# Altium schematic sheet RS485_ISO.SchDoc
size 420 x 297 mm; Organization: Altium Limited; Address1: L3, 12a Rodborough Rd; Address2: Frenchs Forest; Address3: NSW; Address4: Australia 2086
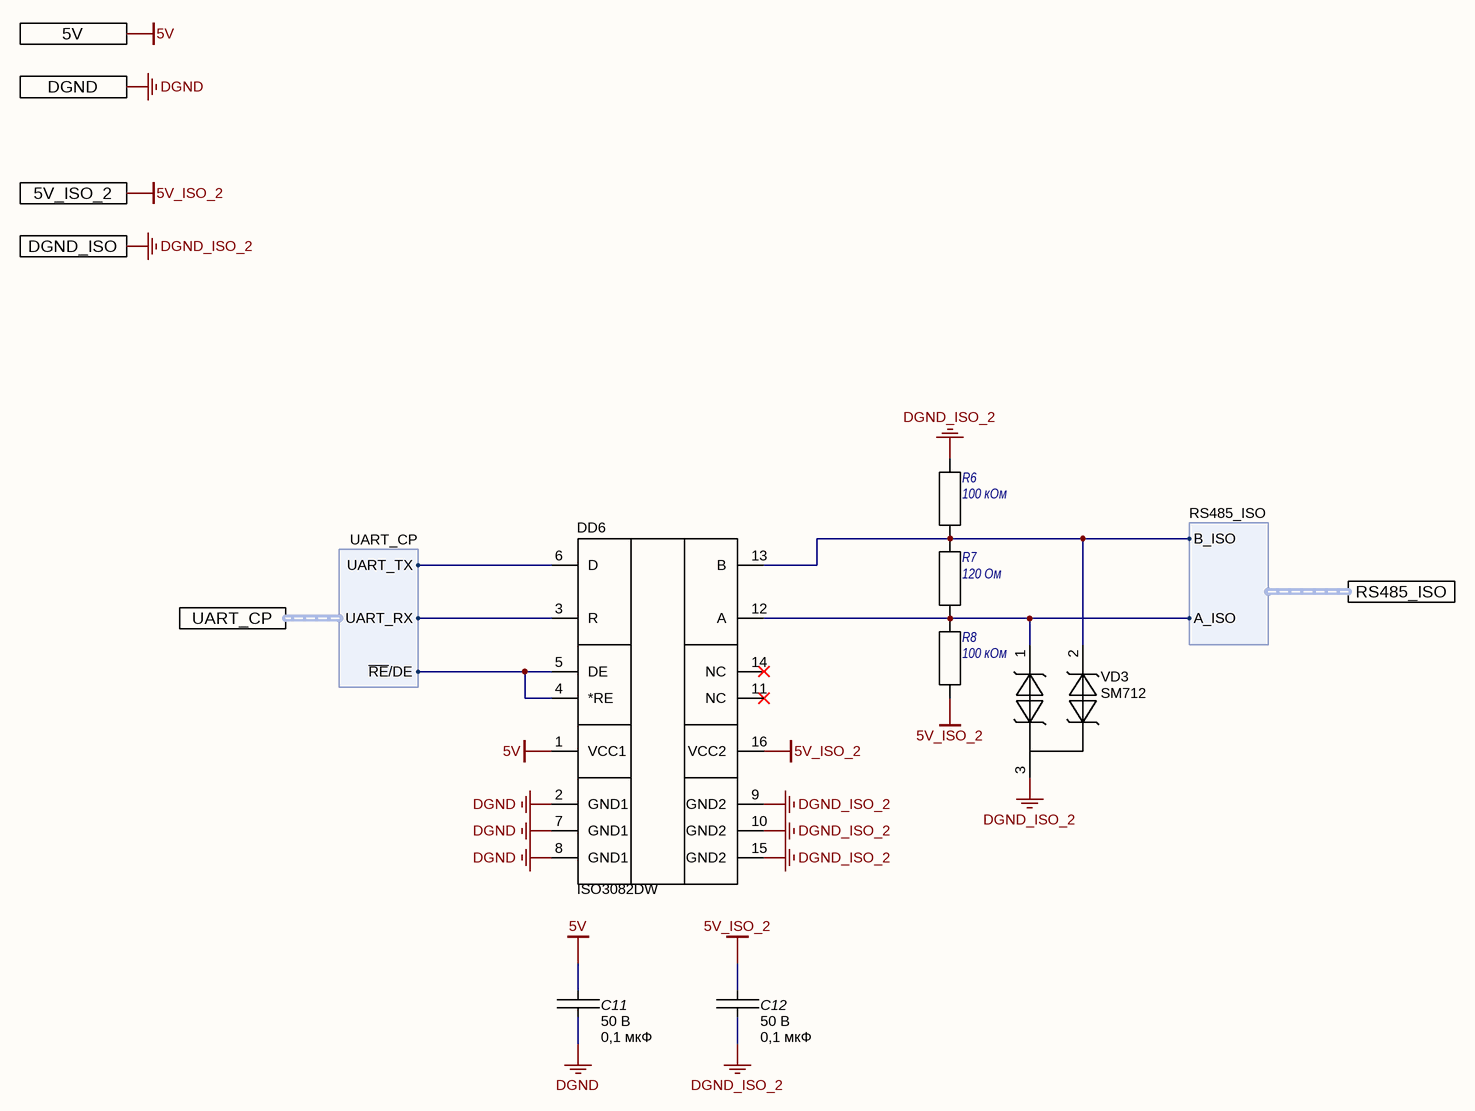
[diagram p0: RS485_ISO.SchDoc]

## Parts
C11  Voltage: 50 В  [C0603C]  (hidden comment: 0,1 мкФ)
C12  Voltage: 50 В  [C0603C]  (hidden comment: 0,1 мкФ)
DD6  ISO3082DW  [SOIC-Wide-16]
R6  100 кОм  [C0603R]
R7  120 Ом  [C0603R]
R8  100 кОм  [C0603R]
VD3  SM712  [SOT23-3]

## Ports
5V, 5V_ISO_2, DGND, DGND_ISO, RS485_ISO (harness RS485_ISO), UART_CP (harness UART_CP)

## Harnesses
UART_CP: UART_TX, UART_RX, ~{RE}/DE
RS485_ISO: B_ISO, A_ISO

## Nets
5V: C11.1 DD6.1(VCC1) ; port 5V
5V_ISO_2: C12.1 DD6.16(VCC2) R8.2 ; port 5V_ISO_2
DGND: C11.2 DD6.2(GND1) DD6.7(GND1) DD6.8(GND1) ; port DGND
DGND_ISO_2: C12.2 DD6.9(GND2) DD6.10(GND2) DD6.15(GND2) R6.1 VD3.3 ; port DGND_ISO
NetDD6_3: DD6.3(R) ; port UART_CP.UART_RX
NetDD6_4: DD6.4(*RE) DD6.5(DE) ; port UART_CP.~{RE}/DE
NetDD6_6: DD6.6(D) ; port UART_CP.UART_TX
NetDD6_12: DD6.12(A) R7.2 R8.1 VD3.1 ; port RS485_ISO.A_ISO
NetDD6_13: DD6.13(B) R6.2 R7.1 VD3.2 ; port RS485_ISO.B_ISO

Not connected (* = marked no-connect by the designer): DD6 11(NC)* 14(NC)*

## Notes on the sheet
- Подп. и дата
- Инв. № дубл.
- Взам. инв. №
- Инв. № подл.
- Изм.
- Лист
- № докум.
- Подп.
- Дата
- 2.106-A3
- Копировал
- Формат А3

## Library data of the parts
C11 C12 = CC0603KRX7R9BB104: SMD 0603 ; X7R; 0,1 мкФ; 50 В; Manufacturer: YAGEO; Persent: ±5%; Type: Ceramic; Part Number: CC0603KRX7R9BB104; Package: SMD 0603; Dielectric: X7R; ComponentLink1Description: Datasheet; Value: 0,1 мкФ
DD6 = ISO3082DW: RS-485 Transceivers; Manufacturer: Texas Instruments; Part Number: ISO3082DW; Type: Special
R6 R8 = RC0603FR-07100KL: SMD 0603; 0,1; 1%; 100 кОм; Manufacturer: Yageo; Power: 0,1; Part Number: RC0603FR-07100KL; Package: SMD 0603; Persent: 1%; Value: 100 кОм; Category: R
R7 = RC0603FR-07120RL: SMD 0603; 0,1; 1%; 120 Ом; Manufacturer: Yageo; Power: 0,1; Part Number: RC0603FR-07120RL; Package: SMD 0603; Persent: 1%; Value: 120 Ом; Category: R
VD3 = SM712.TCT: TVS RS485; Manufacturer: Semtech; Part Number: SM712.TCT; Type: TVS